# EasyEDA Pro project head_control.eprj, board PCB1
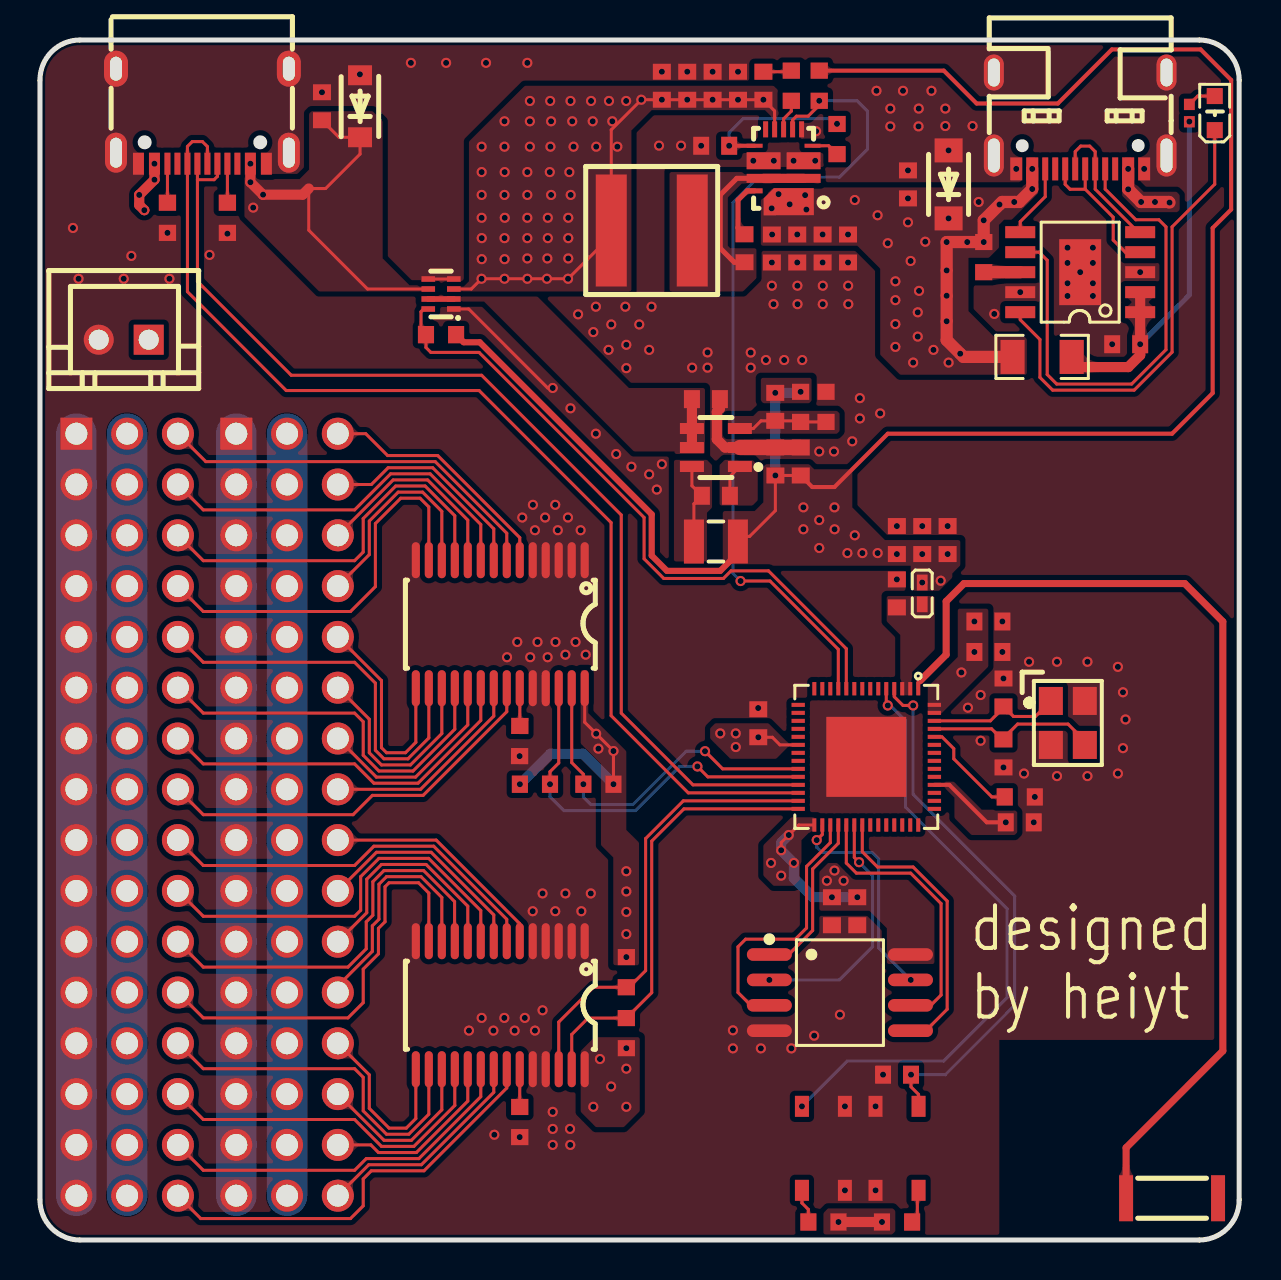
[diagram p2: board, top side]
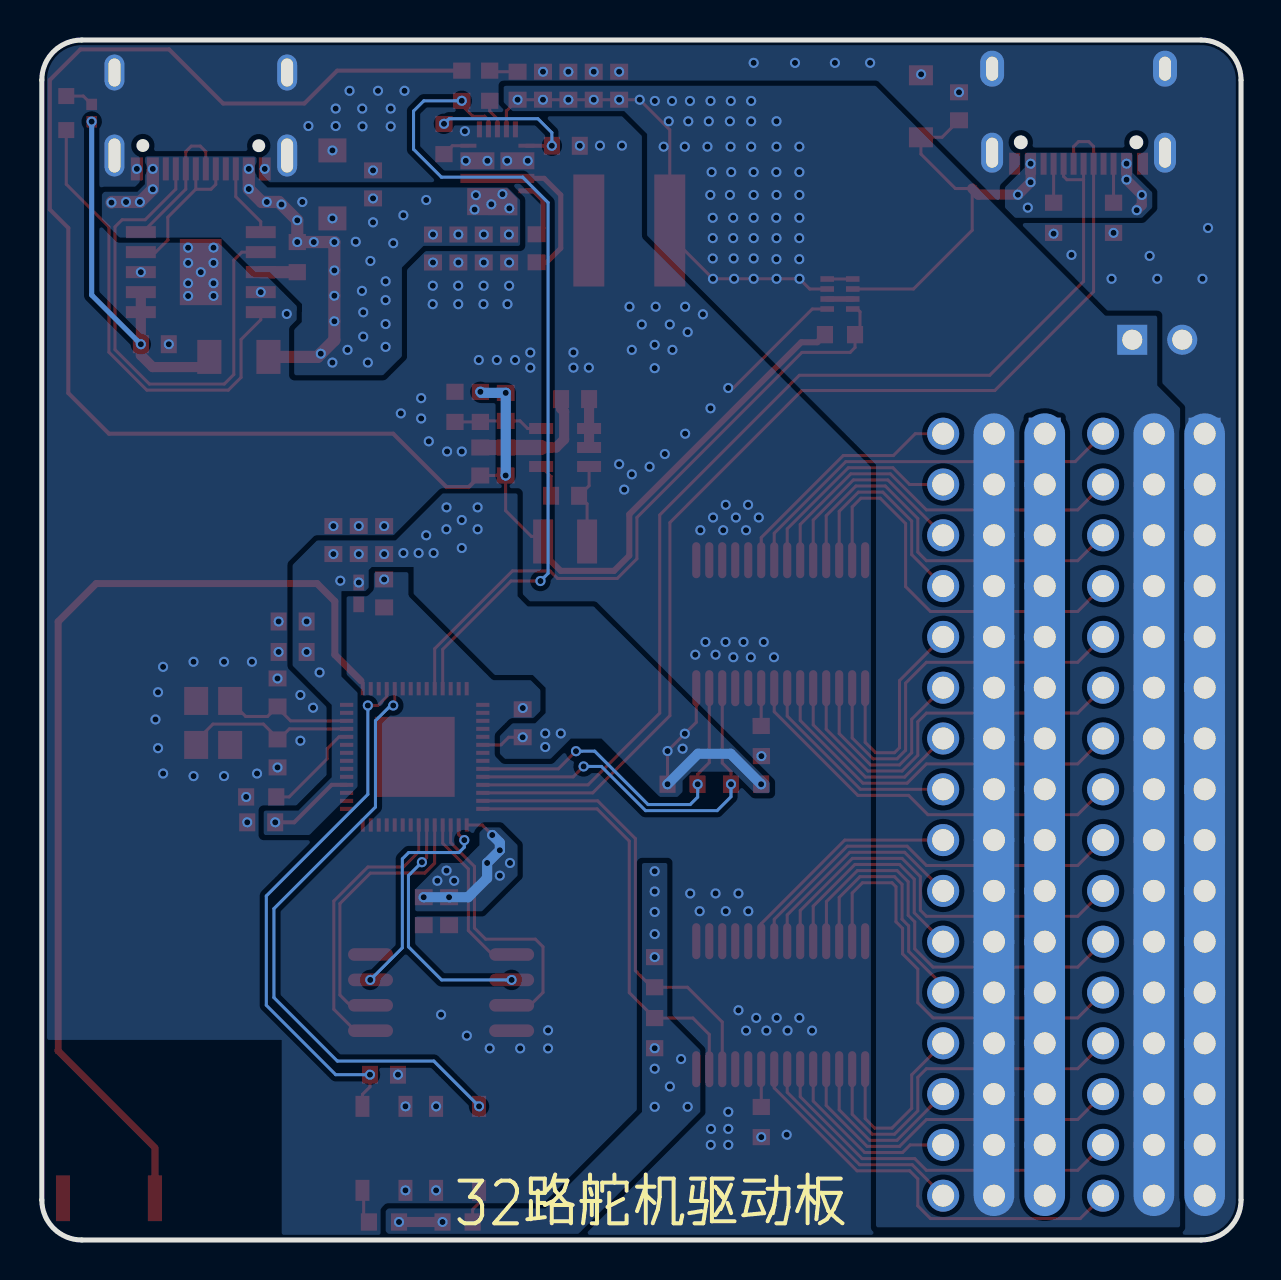
[diagram p3: board, bottom side, seen from below]

Outline 60 x 60 mm; copper layers: Top Layer, Inner1, Inner2, Bottom Layer. Coordinates in mm from the lower left corner of the outline.
Outline path: 0,58 0,2 arc(0.59,0.59) 2,0 58,0 arc(59.41,0.59) 60,2 60,58 arc(59.41,59.41) 58,60 2,60 arc(0.59,59.41) 0,58
Stack: Top Layer 0.035mm 外层铜厚1oz / Dielectric1 0.2104mm 7628 RC49% 8.6mil / Inner1 0.0152mm 内层铜厚 / Dielectric2 1.065mm 1.1mm H/HOZ Copper / Inner2 0.0152mm 内层铜厚 / Dielectric3 0.2104mm 7628 RC49% 8.6mil / Bottom Layer 0.035mm 外层铜厚1oz

## Design rules (mm)
template: 自定义配置
spacing copperThickness1oz (default): track to track 0.152, other pairs 0.152 to 0.3
spacing copperThickness2oz: track to track 0.203, other pairs 0.152 to 0.3
track width copperThickness1oz (default): min 0.102, default 0.152, max 2.54
track width copperThickness2oz: min 0.203, default 0.254, max 2.54
differential pair differentialPair (default): width min 0.127, default 0.254, max 2.54; gap min 0.152, default 0.152
via viaSize (default): diameter min 0.5, default 0.508, max 10; hole min 0.3, default 0.305, max 6.3

## Placement (name value [footprint] x y rotation side)
BOOT1  TSA016A2518A  [KEY-SMD_4P-L4.2-W3.4-P2.15-LS4.5-TL]  39.2 4.58 90 top
C1  100nF  [C0603]  47.45 29.4 180 top
C2  10pF  [C0603]  48.21 27.38 90 top
C3  1uF  [C0603]  42.88 8.27 180 top
C4  1uF  [C0603]  47.45 30.93 180 top
C5  10uF  [C0603]  42.87 35 270 top
C6  1uF  [C0603]  44.14 35 270 top
C7  100nF  [C0603]  45.41 35 270 top
C8  100nF  [C0603]  42.87 32.33 270 top
C9  10pF  [C0603]  48.21 24.33 270 top
C10  100nF  [C0603]  49.02 20.88 180 top
C11  100nF  [C0603]  35.94 25.84 270 top
C12  100nF  [C0603]  39.62 16.44 90 top
C13  22uF  [C0603]  36.79 38.93 90 top
C14  1uF  [C0603]  40.89 16.44 270 top
C15  22uF  [C0603]  38.06 38.93 90 top
C16  100nF  [C0603]  33.82 37.21 180 top
C17  220pF  [C0603]  36.79 41.66 270 top
C18  10uF  [C0603]  33.32 42.04 180 top
C19  1uF  [C0603]  54.35 44.79 180 top
C20  10uF  [C0603]  43.43 52.78 90 top
C21  100nF  [C0603]  35.25 49.59 270 top
C22  10uF  [C0603]  14.11 56.69 90 top
C23  100nF  [C0603]  40.43 49.58 90 top
C24  100pF  [C0603]  36.19 57.71 270 top
C25  2.2uF  [C0603]  33.78 54.71 180 top
CN2  HX-XH2.54-2PZZ  [CONN-TH_2P-P2.50_HX-2.54MM-2P-ZZ-MS]  4.19 45.01 180 top
D1  SMF20A  [SOD-123FL_L2.8-W1.9-LS3.7-RD]  45.46 52.78 90 top
D2  SMF5.0A  [SOD-123F_L2.8-W1.8-LS3.7-RD]  16.01 56.69 90 top
H2  KH-2.54PH180-3X16P-L11.5  [HDR-TH_48P-P2.54-V-M-R3-C16-S2.54_1]  12.36 21.27 270 top
H3  KH-2.54PH180-3X16P-L11.5  [HDR-TH_48P-P2.54-V-M-R3-C16-S2.54_1]  4.36 21.27 270 top
L1  2nH  [L0402]  44.14 32.33 270 top
L2  2.2uH  [IND-SMD_L2.5-W2.0_MHCHL2520]  33.82 34.93 0 top
LED1  SZYY0603R  [LED0603-R-RD]  58.78 56.35 90 top
R1  4.7kΩ  [R0603]  42.88 0.9 0 top
R2  10kΩ  [R0603]  24 5.9 270 top
R3  10kΩ  [R0603]  24 24.95 269.6 top
R4  4.7kΩ  [R0603]  39.2 0.9 180 top
R5  4.7kΩ  [R0603]  27.94 22.79 180 top
R6  4.7kΩ  [R0603]  24.76 22.79 0 top
R7  4.7kΩ  [R0603]  29.34 10.34 90 top
R8  4.7kΩ  [R0603]  29.34 13.39 270 top
R9  100kΩ  [R0603]  38.06 41.66 90 top
R10  22.1kΩ  [R0603]  39.33 41.66 90 top
R11  1kΩ  [R1206]  50.14 44.15 180 top
R12  4.7kΩ  [R0402]  57.51 56.35 90 top
R13  10kΩ  [R0603]  47.22 49.14 270 top
R14  5.1kΩ  [R0603]  9.38 51.11 270 top
R15  1kΩ  [R0603]  37.59 57.71 270 top
R16  5.1kΩ  [R0603]  6.38 51.11 270 top
R17  100kΩ  [R0603]  39.88 55.05 90 top
R18  10kΩ  [R0603]  20.07 45.27 0 top
R28  10kΩ  [R0603]  38.99 57.71 270 top
R29  10kΩ  [R0603]  49.02 22.15 180 top
RST1  TSA016A2518A  [KEY-SMD_4P-L4.2-W3.4-P2.15-LS4.5-TL]  42.88 4.58 90 top
U1  ADWH002  [ANT-SMD_L5.0-W2.0_HM5B]  56.64 2.09 180 top
U2  PCA9685PW,118  [TSSOP-28_L9.7-W4.4-P0.65-LS6.4-TL]  23.03 11.74 270 top
U3  PCA9685PW,118  [TSSOP-28_L9.7-W4.4-P0.65-LS6.4-TL]  23.03 30.79 270 top
U4  ESP32-S3R8  [QFN-56_L7.0-W7.0-P0.40-TL-EP4.0]  41.34 24.16 270 top
U5  BY25Q64ASSIG(T)  [SOIC-8_L5.3-W5.3-P1.27-LS8.0-BL]  40.02 12.37 270 top
U6  SY8113IADC  [TSOT-23-6_L2.9-W1.6-P0.95-LS2.8-BL]  33.82 39.62 90 top
U7  LM66200DRLR  [SOT-583-8_L2.1-W1.2-P0.50-LS1.6-BL]  20.07 47.3 90 top
U8  CH224K  [ESSOP-10_L4.9-W3.9-P1.0-LS6.0-TL-EP]  52.05 48.39 90 top
U9  1.5uH  [IND-SMD_L6.6-W6.4_FEXL0630A-1R5M]  30.61 50.47 270 top
U16  22uF  [C0603]  34.93 57.71 270 top
U17  22uF  [C0603]  33.66 57.71 270 top
U18  22uF  [C0603]  32.38 57.71 270 top
U19  22uF  [C0603]  31.12 57.71 270 top
U20  TPS513885VABR  [VQFN-HR-13_L4.0-W3.0_TPS51388VABR]  37.21 53.72 180 top
U21  22uF  [C0603]  36.62 49.58 90 top
U22  22uF  [C0603]  37.89 49.58 90 top
U23  22uF  [C0603]  39.16 49.58 90 top
USB1  TYPEC-304-ACP16  [USB-C-SMD_TYPE-C-16P-1]  52.05 55.97 180 top
USB2  TYPE-C 16PIN 2MD(073)  [USB-C-SMD_TYPE-C-6PIN-2MD-073]  8.13 56.19 180 top
X1  40MHz  [OSC-SMD_4P-L3.2-W2.5-BL_SIT8008BI]  51.43 25.85 270 top

## Footprints (pads in the part's own frame, mm; a bottom-side part is the same pattern mirrored in y, then rotated)
ANT-SMD_L5.0-W2.0_HM5B
  rect 0.7x2.3 smd: 1(-2.3,0) 2(2.3,0)
C0603
  rect 0.8x0.9 smd: 1(-0.7,0) 2(0.7,0)
CONN-TH_2P-P2.50_HX-2.54MM-2P-ZZ-MS
  rect 1.5x1.5 hole 1: 1(-1.25,0)
  round 1.5 hole 1: 2(1.25,0)
ESSOP-10_L4.9-W3.9-P1.0-LS6.0-TL-EP
  rect 0.6x1.5 smd: 1(-2,-3) 2(-1,-3) 3(0,-3) 4(1,-3) 5(2,-3) 6(2,3) 7(1,3) 8(0,3) 9(-1,3) 10(-2,3)
  rect 3.3x2.1 smd: 11(0,0)
HDR-TH_48P-P2.54-V-M-R3-C16-S2.54_1
  rect 1.6x1.6 hole 1.1: 1(-19.05,-2.54)
  round 1.6 hole 1.1: 2(-19.05,0) 3(-19.05,2.54) 4(-16.51,-2.54) 5(-16.51,0) 6(-16.51,2.54) 7(-13.97,-2.54) 8(-13.97,0) 9(-13.97,2.54) 10(-11.43,-2.54) 11(-11.43,0) 12(-11.43,2.54) 13(-8.89,-2.54) 14(-8.89,0) 15(-8.89,2.54) 16(-6.35,-2.54) 17(-6.35,0) 18(-6.35,2.54) 19(-3.81,-2.54) 20(-3.81,0) 21(-3.81,2.54) 22(-1.27,-2.54) 23(-1.27,0) 24(-1.27,2.54) 25(1.27,-2.54) 26(1.27,0) 27(1.27,2.54) 28(3.81,-2.54) 29(3.81,0) 30(3.81,2.54) 31(6.35,-2.54) 32(6.35,0) 33(6.35,2.54) 34(8.89,-2.54) 35(8.89,0) 36(8.89,2.54) 37(11.43,-2.54) 38(11.43,0) 39(11.43,2.54) 40(13.97,-2.54) 41(13.97,0) 42(13.97,2.54) 43(16.51,-2.54) 44(16.51,0) 45(16.51,2.54) 46(19.05,-2.54) 47(19.05,0) 48(19.05,2.54)
IND-SMD_L2.5-W2.0_MHCHL2520
  rect 1x2.2 smd: 1(-1.1,0) 2(1.1,0)
IND-SMD_L6.6-W6.4_FEXL0630A-1R5M
  rect 5.6x1.55 smd: 1(0,2.025) 2(0,-2.025)
KEY-SMD_4P-L4.2-W3.4-P2.15-LS4.5-TL
  rect 1.05x0.7 smd: 1(-2.1,1.075) 2(2.1,1.075) 3(-2.1,-1.075) 4(2.1,-1.075)
L0402
  rect 0.79x0.54 smd: 1(-0.545,0) 2(0.545,0)
LED0603-R-RD
  rect 0.8x0.8 smd: 1(0.851,0) 2(-0.851,0)
OSC-SMD_4P-L3.2-W2.5-BL_SIT8008BI
  rect 1.4x1.2 smd: 1(-1.1,-0.85) 2(1.1,-0.85) 3(1.1,0.85) 4(-1.1,0.85)
QFN-56_L7.0-W7.0-P0.40-TL-EP4.0
  rect 0.665x0.2 smd: 1(-3.408,2.6) 2(-3.408,2.2) 3(-3.408,1.8) 4(-3.408,1.4) 5(-3.408,1) 6(-3.408,0.6) 7(-3.408,0.2) 8(-3.408,-0.2) 9(-3.408,-0.6) 10(-3.408,-1) 11(-3.408,-1.4) 12(-3.408,-1.8) 13(-3.408,-2.2) 14(-3.408,-2.6) 29(3.408,-2.6) 30(3.408,-2.2) 31(3.408,-1.8) 32(3.408,-1.4) 33(3.408,-1) 34(3.408,-0.6) 35(3.408,-0.2) 36(3.408,0.2) 37(3.408,0.6) 38(3.408,1) 39(3.408,1.4) 40(3.408,1.8) 41(3.408,2.2) 42(3.408,2.6)
  rect 0.2x0.665 smd: 15(-2.6,-3.408) 16(-2.2,-3.408) 17(-1.8,-3.408) 18(-1.4,-3.408) 19(-1,-3.408) 20(-0.6,-3.408) 21(-0.2,-3.408) 22(0.2,-3.408) 23(0.6,-3.408) 24(1,-3.408) 25(1.4,-3.408) 26(1.8,-3.408) 27(2.2,-3.408) 28(2.6,-3.408) 43(2.6,3.408) 44(2.2,3.408) 45(1.8,3.408) 46(1.4,3.408) 47(1,3.408) 48(0.6,3.408) 49(0.2,3.408) 50(-0.2,3.408) 51(-0.6,3.408) 52(-1,3.408) 53(-1.4,3.408) 54(-1.8,3.408) 55(-2.2,3.408) 56(-2.6,3.408)
  rect 4x4 smd: 57(0,0)
R0402
  rect 0.566x0.54 smd: 1(-0.433,0) 2(0.433,0)
R0603
  rect 0.806x0.864 smd: 1(-0.753,0) 2(0.753,0)
R1206
  rect 1.208x1.701 smd: 1(-1.479,0) 2(1.479,0)
SOD-123F_L2.8-W1.8-LS3.7-RD
  rect 1x1.2 smd: 1(-1.55,0) 2(1.55,0)
SOD-123FL_L2.8-W1.9-LS3.7-RD
  rect 1.2x1.4 smd: 1(-1.7,0) 2(1.7,0)
SOIC-8_L5.3-W5.3-P1.27-LS8.0-BL
  oval 0.63x2.25 smd: 1(-1.905,-3.53) 2(-0.635,-3.53) 3(0.635,-3.53) 4(1.905,-3.53) 5(1.905,3.53) 6(0.635,3.53) 7(-0.635,3.53) 8(-1.905,3.53)
SOT-583-8_L2.1-W1.2-P0.50-LS1.6-BL
  rect 0.28x0.68 smd: 1(-0.75,-0.64) 2(-0.25,-0.64) 3(0.25,-0.64) 4(0.75,-0.64) 5(0.75,0.64) 6(0.25,0.64) 7(-0.25,0.64) 8(-0.75,0.64)
TSOT-23-6_L2.9-W1.6-P0.95-LS2.8-BL
  rect 0.55x1.2 smd: 1(-0.95,-1.2) 2(0,-1.2) 3(0.95,-1.2) 4(0.95,1.2) 5(0,1.2) 6(-0.95,1.2)
TSSOP-28_L9.7-W4.4-P0.65-LS6.4-TL
  oval 1.804x0.406 smd: 1(-3.2,4.225) 2(-3.2,3.575) 3(-3.2,2.925) 4(-3.2,2.275) 5(-3.2,1.625) 6(-3.2,0.975) 7(-3.2,0.325) 8(-3.2,-0.325) 9(-3.2,-0.975) 10(-3.2,-1.625) 11(-3.2,-2.275) 12(-3.2,-2.925) 13(-3.2,-3.575) 14(-3.2,-4.225) 15(3.2,-4.225) 16(3.2,-3.575) 17(3.2,-2.925) 18(3.2,-2.275) 19(3.2,-1.625) 20(3.2,-0.975) 21(3.2,-0.325) 22(3.2,0.325) 23(3.2,0.975) 24(3.2,1.625) 25(3.2,2.275) 26(3.2,2.925) 27(3.2,3.575) 28(3.2,4.225)
USB-C-SMD_TYPE-C-6PIN-2MD-073
  rect 0.55x1.1 smd: 1(-3.2,2.375) 2(-2.4,2.375) 11(2.4,2.375) 12(3.2,2.375)
  rect 0.3x1.1 smd: 3(-1.75,2.375) 4(-1.25,2.375) 5(-0.75,2.375) 6(-0.25,2.375) 7(0.25,2.375) 8(0.75,2.375) 9(1.25,2.375) 10(1.75,2.375)
  oval 1.1x2 hole 0.6x1.5: 13(-4.325,1.825) 14(4.325,1.825)
  oval 1.2x1.8 hole 0.6x1.2: 13(-4.325,-2.375) 14(4.325,-2.375)
USB-C-SMD_TYPE-C-16P-1
  rect 0.6x1.15 smd: A1B12(-3.2,2.41) A4B9(-2.4,2.41) B1A12(3.2,2.41) B4A9(2.4,2.41)
  rect 0.3x1.15 smd: A5(-1.25,2.41) A6(-0.25,2.41) A7(0.25,2.41) A8(1.25,2.41) B5(1.75,2.41) B6(0.75,2.41) B7(-0.75,2.41) B8(-1.75,2.41)
  oval 1x2.1 hole 0.6x1.7: EP(-4.32,1.74) EP(4.32,1.74)
  oval 1x1.8 hole 0.6x1.4: EP(-4.32,-2.41) EP(4.32,-2.41)
VQFN-HR-13_L4.0-W3.0_TPS51388VABR
  custom 2.515x1.36 smd: 1(-0.257,1.81)
  rect 1.7x0.45 smd: 2(-1,0.64) 12(1,0.64)
  rect 1.7x0.85 smd: 3(-1,-0.24) 11(1,-0.24)
  rect 0.8x0.2 smd: 4(-1.45,-0.99) 10(1.45,-0.99)
  rect 0.25x0.8 smd: 5(-0.9,-1.81) 6(-0.45,-1.81) 7(0,-1.81) 8(0.45,-1.81) 9(0.9,-1.81)
  rect 0.8x0.25 smd: 13(1.45,1.265)

## Nets
As in the schematic.

Pads without a net: U1 1; U4 6 7 8 9 12 13 14 15 16 17 18 19 21 22 36 37 38 39 40 41 42 43 44 45 47 48 49 50 51; U20 9; USB1 A8 B8; USB2 3 9

## Via types
v1: diameter 0.508, hole 0.305, Top Layer to Bottom Layer, 353 vias

## Routing (per net, layer and track width the routed paths; a pad name or vN(x,y) marks a point on that pad's centre or on a via; arc(x,y) is an arc through that point)
3V3: length 114.3
  Top Layer w0.152: C15.1 v1(36.79,38.23) 36.79,36.47 35.5,35.18 34.92,35.18 ; v1(35.94,25.14) 36.64,25.14 37.02,24.76 U4.20 ; U3.28 27.25,25.89 v1(27.83,25.31) v1(28.69,24.45) v1(28.69,22.79)
  Top Layer w0.203: v1(48.32,20.88) 47.37,20.88 45.5,22.76 U4.46 ; C15.1 38.64,37.65 39.75,37.65 42.42,40.31 56.64,40.31 58.67,42.35 58.67,50.6 59.6,51.53 59.6,58 58.07,59.53 53.63,59.53 50.93,56.83 46.86,56.83 45.22,58.47 R28.1
  Top Layer w0.305: 34.92,35.18 35.12,34.97 35.12,34.54 34.04,33.46 31.37,33.46 30.61,34.22 30.61,36.28 22,44.89 21.2,44.89 R18.2
  Top Layer w0.508: v1(39.95,0.9) v1(42.13,0.9)
  Bottom Layer w0.152: v1(36.79,38.23) 36.79,38.23
  Bottom Layer w0.508: v1(28.69,22.79) 27.17,24.31 25.54,24.31 v1(24.01,22.79) ; 36.79,38.23 v1(36.79,42.36) 38.01,42.36 v1(38.06,42.41)
  vias: v1(27.69,6.66) v1(27.94,24.57) v1(28.02,9.05) v1(28.57,7.68) v1(29.34,18.44) v1(29.34,17.43) v1(29.34,16.4) v1(29.34,15.3) v1(29.34,14.14) v1(29.34,9.59) v1(29.34,8.56) v1(29.34,6.66) v1(34.04,25.33) v1(34.81,25.33) v1(34.81,24.65) v1(38.2,36.63) v1(38.2,35.54) v1(38.99,36) v1(38.99,34.6) v1(39.75,36.63) v1(39.76,35.54) v1(40.4,34.35) v1(40.77,35.23) v1(41.15,34.35) v1(41.91,34.35) v1(42.87,34.3) v1(44.14,34.3) v1(44.14,32.87) v1(45.07,32.96) v1(45.41,34.3) v1(46.1,28.38) v1(46.75,30.93) v1(46.75,29.4)
+5V: length 22.6
  Top Layer w0.152: C22.1 14.96,55.14 D2.1 16.01,54.3 14.29,52.57 13.45,52.57 13.45,50.49 16.39,47.55 U7.6
  Top Layer w0.508: v1(5.22,51.49) 4.97,51.75 v1(4.97,52.25) v1(5.73,53.02) v1(5.73,53.81) ; v1(10.53,53.81) v1(10.53,52.89) 11.15,52.27 v1(11.16,52.27) 13.14,52.27 13.45,52.57
  vias: v1(10.67,51.62)
GND: length 90.5
  Top Layer w0.152: U7.4 U7.5 ; v1(25.65,42.6) 25.4,42.6 21.45,46.55 U7.1
  Top Layer w0.508: U6.2 34.27,39.62 33.87,40.03 33.87,41.42 34.02,41.57 C18.1
  Top Layer w0.762: 35.02,39.63 C13.2 C15.2
  Bottom Layer w2.032: H3.46 H3.43 H3.40 H3.37 H3.34 H3.31 H3.28 H3.25 H3.22 H3.19 H3.16 H3.13 H3.10 H3.7 H3.4 H3.1 ; H2.46 H2.43 H2.40 H2.37 H2.34 H2.31 H2.28 H2.25 H2.22 H2.19 H2.16 H2.13 H2.10 H2.7 H2.4 H2.1
  vias: v1(1.65,50.6) v1(1.93,48.06) v1(4.19,48.06) v1(4.57,49.2) v1(6.38,50.36) v1(6.48,48.06) v1(8.48,49.25) v1(9.38,50.31) v1(14.11,57.39) v1(16.01,58.28) v1(18.56,58.86) v1(20.32,58.86) v1(21.46,10.47) v1(22.1,11.1) v1(22.32,58.86) v1(22.69,10.47) v1(22.73,5.26) v1(23.23,11.1) v1(23.37,29.14) v1(23.75,10.47) v1(23.88,29.9) v1(24,24.19) v1(24,5.14) v1(24.13,36.12) v1(24.26,11.1) v1(24.38,58.86) v1(24.53,29.14) v1(24.66,36.76) v1(24.65,16.44) v1(24.76,35.49) v1(24.76,10.47) v1(24.89,29.9) v1(25.15,17.33) v1(25.15,11.49) v1(25.27,36.12) v1(25.4,29.14) v1(25.65,6.41) v1(25.65,5.55) v1(25.65,4.75) v1(25.78,36.76) v1(25.79,29.9) v1(25.78,16.44) v1(25.91,35.49) v1(26.29,29.27) v1(26.29,17.33) v1(26.42,36.12) v1(26.54,41.58) v1(26.52,5.55) v1(26.53,4.75) v1(26.8,29.9) v1(26.92,46.28) v1(27.05,35.49) v1(27.09,16.44) v1(27.31,29.27) v1(27.56,17.33) v1(27.69,45.39) v1(27.81,46.67) v1(27.81,40.31) v1(28.45,44.51) v1(28.58,45.78) v1(28.83,39.3) v1(29.29,46.67) v1(29.34,44.76) v1(29.34,43.59) v1(29.59,38.66) v1(29.98,45.78) v1(30.48,44.51) v1(30.48,38.28) v1(30.6,46.67) v1(30.86,37.52) v1(30.97,54.72) v1(31.12,58.41) v1(31.12,38.79) v1(32.07,54.72) v1(32.38,58.41) v1(32.63,43.62) v1(33.08,54.71) v1(33.4,44.38) v1(33.4,43.62) v1(33.66,58.41) v1(34.67,10.48) v1(34.67,9.58) v1(34.93,58.41) v1(35.56,44.37) v1(35.56,43.62) v1(35.69,53.96) v1(35.93,26.6) v1(36.07,9.58) v1(36.32,44) v1(36.62,48.88) v1(36.62,47.71) v1(36.72,53.96) v1(36.7,46.79) v1(37.23,44) v1(37.59,9.58) v1(37.7,53.96) v1(37.89,48.88) v1(37.9,47.71) v1(37.9,46.79) v1(38.14,44) v1(38.74,10.22) v1(38.83,55.44) v1(38.79,53.96) v1(38.99,39.43) v1(39.16,48.88) v1(39.17,47.71) v1(39.16,46.79) v1(39.72,39.43) v1(40.02,11.27) v1(40.27,6.68) v1(40.27,2.48) v1(40.43,48.88) v1(40.44,47.71) v1(40.44,46.79) v1(40.64,39.93) v1(41.02,42.09) v1(41.02,41.08) v1(41.81,6.68) v1(41.81,2.48) v1(41.85,57.46) v1(42.04,41.33) v1(42.18,8.27) v1(42.54,56.57) v1(42.54,55.68) v1(42.87,35.7) v1(42.87,33.03) v1(43.18,57.46) v1(43.43,53.48) v1(43.97,56.57) v1(43.96,55.68) v1(44.14,35.7) v1(44.6,57.46) v1(45.3,56.57) v1(45.3,55.7) v1(45.41,35.7) v1(45.46,54.48) v1(46.43,26.61) v1(46.66,55.7) v1(47.06,27.25) v1(47.06,24.96) v1(47.75,46.3) v1(48.15,30.93) v1(48.15,29.4) v1(48.21,28.08) v1(48.21,23.63) v1(48.85,53.56) v1(49.05,47.39) v1(49.23,23.32) v1(49.49,28.91) v1(49.72,20.88) v1(49.78,22.15) v1(50.88,28.91) v1(50.88,23.2) v1(51.41,49.61) v1(51.41,48.85) v1(51.41,47.84) v1(51.41,47.2) v1(52.05,48.39) v1(52.41,28.91) v1(52.41,23.2) v1(52.68,49.61) v1(52.68,48.85) v1(52.68,47.84) v1(52.68,47.2) v1(53.65,44.79) v1(53.93,28.66) v1(53.93,23.32) v1(54.19,27.39) v1(54.19,24.59) v1(54.31,26.03) v1(55.05,48.39) v1(55.25,53.56)
VDD_SPI: length 8.6
  Top Layer w0.152: U4.29 37.97,20.75 v1(37.47,20.25) 37.08,19.87 v1(37.08,19.49)
  Bottom Layer w0.508: v1(37.47,20.25) 37.08,19.87 v1(37.08,19.49) v1(37.72,18.85) 37.72,18.09 38.67,17.14 v1(39.62,17.14) v1(40.89,17.14)
  vias: v1(36.58,18.85) v1(37.08,18.22) v1(39.37,17.96) v1(39.75,18.47) v1(40.21,17.96)
BOOT: length 30.5
  Top Layer w0.152: v1(42.42,26.73) 42.34,26.8 U4.5
  Bottom Layer w0.152: v1(42.42,26.73) 42.54,26.73 43.31,25.96 43.31,21.65 48.39,16.57 48.39,12.12 45.21,8.95 40.39,8.95 v1(38.12,6.68)
CC1: length 25.1
  Top Layer w0.152: USB1.A5 53.3,52.55 54.83,51.01 55.98,51.01 56.34,50.66 56.34,44.52 54.62,42.8 50.87,42.8 50.39,43.27 50.39,48.99 49.99,49.39 U8.7
CC2: length 3.7
  Top Layer w0.152: USB1.B5 50.3,52.17 49.05,50.92 U8.6
CH224K_VDD: length 19.2
  Top Layer w0.508: R11.1 51.62,44.07 52.05,43.65 54.45,43.65 55.05,44.24 v1(55.05,44.79) U8.1 U8.2
  Bottom Layer w0.254: v1(57.51,55.92) 57.51,47.25 v1(55.05,44.79)
CHIP_EN: length 27
  Top Layer w0.152: v1(43.69,26.73) 43.18,26.73 42.74,27.16 U4.4 ; v1(43.58,8.27) 43.58,7.66 43.96,7.28 RST1.4
  Bottom Layer w0.152: v1(43.69,26.73) 43.69,22.28 48.77,17.2 48.77,11.74 45.29,8.27 v1(43.58,8.27)
DIODE_ST: length 33.1
  Top Layer w0.152: U4.10 40.34,29.56 36.45,33.46 34.57,33.46 34.19,33.08 31.21,33.08 30.23,34.06 30.23,36.12 21.97,44.38 19.56,44.38 19.31,44.62 R18.1 19.06,45.52 19.06,46.41 19.2,46.55 U7.8
PD_5V: length 100.4
  Top Layer w0.152: U20.8 36.76,56.45 v1(36.19,57.01) v1(34.93,57.01) v1(33.66,57.01) v1(32.38,57.01) v1(31.12,57.01) v1(30.09,57.01) 28.58,55.51 U9.2 28.58,50.22 v1(26.42,48.06) v1(25.36,48.06) v1(24.38,48.06) v1(23.24,48.06) v1(22.09,48.06) 21.58,47.55 U7.3
  Bottom Layer w2.032: H2.2 H2.5 H2.8 H2.11 H2.14 H2.17 H2.20 H2.23 H2.26 H2.29 H2.32 H2.35 H2.38 H2.41 H2.44 H2.47 ; H3.2 H3.5 H3.8 H3.11 H3.14 H3.17 H3.20 H3.23 H3.26 H3.29 H3.32 H3.35 H3.38 H3.41 H3.44 H3.47
  vias: v1(22.1,54.67) v1(22.1,53.4) v1(22.1,52.25) v1(22.1,51.11) v1(22.1,50.09) v1(22.1,49.04) v1(23.24,55.94) v1(23.24,54.67) v1(23.25,53.4) v1(23.24,52.25) v1(23.24,50.09) v1(23.25,49.04) v1(23.25,51.11) v1(24.38,53.4) v1(24.38,52.25) v1(24.38,51.11) v1(24.38,50.09) v1(24.38,49.08) v1(24.51,56.95) v1(24.51,55.94) v1(24.51,54.67) v1(25.41,51.11) v1(25.41,50.09) v1(25.39,49.08) v1(25.53,56.95) v1(25.54,54.67) v1(25.51,53.4) v1(25.57,55.94) v1(25.57,52.25) v1(26.43,51.11) v1(26.43,50.09) v1(26.43,49.08) v1(26.54,56.95) v1(26.49,53.4) v1(26.63,55.94) v1(26.55,52.25) v1(26.7,54.67) v1(27.57,56.95) v1(27.65,55.94) v1(27.83,54.67) v1(28.47,56.95) v1(28.63,55.94) v1(28.89,54.67) v1(29.33,56.95)
PD_20V: length 18.9
  Top Layer w0.61: v1(47.22,49.9) v1(47.22,50.99) v1(48.01,51.77) 48.14,51.9 v1(48.74,51.9) 49,51.9 v1(49.65,52.55) v1(49.65,53.56) ; v1(54.45,53.56) v1(54.45,52.54) 55.08,51.9 v1(55.09,51.9) v1(55.79,51.9) 56.49,51.9 v1(56.51,51.87) ; 47.22,49.9 v1(46.39,49.9) v1(45.36,49.9) v1(45.36,48.48) v1(45.36,47.21) v1(45.36,45.94) 45.36,44.99 v1(46.04,44.32) 46.2,44.15 R11.2
  vias: v1(36.61,51.58) v1(36.63,50.27) v1(36.95,52.29) v1(37.51,51.78) v1(37.89,50.28) v1(38.28,52.24) v1(38.35,51.52) v1(39.16,50.28) v1(40.43,50.28) v1(40.77,52) v1(41.91,51.24) v1(42.42,49.84) v1(42.8,47.94) v1(42.8,46.99) v1(42.8,45.8) v1(42.8,44.66) v1(43.43,52.08) v1(43.43,50.88) v1(43.56,48.95) v1(43.69,43.87) v1(43.92,46.39) v1(43.92,45.17) v1(43.98,47.46) v1(44.29,49.91) v1(44.7,44.51) v1(45.46,51.08) v1(45.46,43.87) v1(46.97,51.9)
PURE_5V: length 3.7
  Top Layer w0.28: U7.2 U7.7
  Top Layer w0.508: U6.5 U6.4 C18.2
SERVO00: length 12.4
  Top Layer w0.152: U3.6 24,35.12 19.9,39.22 17.39,39.22 16.3,40.31 H2.3
SERVO0A: length 10.7
  Top Layer w0.152: H2.18 16.48,26.04 16.48,24.36 17.09,23.75 18.54,23.75 20.1,25.32 U3.17
SERVO0B: length 19.5
  Top Layer w0.152: U3.18 20.75,25.54 18.66,23.45 16.96,23.45 16.17,24.24 16.17,25.91 15.74,26.34 8.17,26.34 6.9,27.61
SERVO0C: length 10.2
  Top Layer w0.152: U3.19 21.41,25.76 18.79,23.14 16.83,23.14 H2.21
SERVO0D: length 19
  Top Layer w0.152: U3.20 22.06,25.98 18.92,22.84 16.71,22.84 15.74,23.81 8.17,23.81 6.9,25.08
SERVO0E: length 10.7
  Top Layer w0.152: H2.24 19.04,22.53 22.71,26.2 U3.21
SERVO0F: length 20.3
  Top Layer w0.152: 6.9,22.53 8.17,21.27 15.66,21.27 16.63,22.23 19.17,22.23 23.35,26.42 U3.22
SERVO01: length 19.9
  Top Layer w0.152: 6.9,40.31 8.3,38.92 19.77,38.92 23.35,35.34 U3.7
SERVO1A: length 8.8
  Top Layer w0.152: U2.17 20.1,6.51 18.58,4.98 17.21,4.98 H2.42
SERVO1B: length 17.6
  Top Layer w0.152: U2.18 20.75,6.73 18.71,4.68 17.09,4.68 15.74,6.03 8.17,6.03 6.9,7.29
SERVO1C: length 9.3
  Top Layer w0.152: H2.45 16.55,4.75 16.93,4.37 18.83,4.37 21.41,6.95 U2.19
SERVO1D: length 18.6
  Top Layer w0.152: 6.9,4.75 8.17,3.49 15.74,3.49 16.32,4.07 18.96,4.07 22.06,7.17 U2.20
SERVO1E: length 11.1
  Top Layer w0.152: H2.48 16.45,3.76 19.09,3.76 22.71,7.38 U2.21
SERVO1F: length 21.4
  Top Layer w0.152: U2.22 23.35,7.6 19.21,3.46 16.58,3.46 16.17,3.05 16.17,1.71 15.54,1.07 8.04,1.07 6.9,2.22
SERVO02: length 11
  Top Layer w0.152: H2.6 16.58,37.78 17.42,38.61 19.65,38.61 22.71,35.56 U3.8
SERVO03: length 19.3
  Top Layer w0.152: 6.9,37.78 8.17,36.5 15.74,36.5 17.54,38.31 19.52,38.31 22.06,35.78 U3.9
SERVO04: length 10.5
  Top Layer w0.152: U3.10 21.41,35.99 19.4,38 17.67,38 H2.9
SERVO05: length 19.7
  Top Layer w0.152: U3.11 20.75,36.21 19.27,37.7 17.8,37.7 16.17,36.07 16.17,34.4 15.74,33.97 8.17,33.97 6.9,35.23
SERVO06: length 11
  Top Layer w0.152: H2.12 16.48,34.27 16.48,35.95 17.92,37.39 19.14,37.39 20.1,36.43 U3.12
SERVO07: length 20.1
  Top Layer w0.152: 6.9,32.69 8.17,31.42 15.54,31.42 16.78,32.67 16.78,35.82 18.05,37.09 19.02,37.09 19.46,36.65 U3.13
SERVO08: length 11.2
  Top Layer w0.152: U3.15 18.81,24.88 18.29,24.36 17.34,24.36 17.09,24.61 17.09,27.97 H2.15
SERVO09: length 20
  Top Layer w0.152: U3.16 19.46,25.1 18.41,24.06 17.21,24.06 16.78,24.49 16.78,27.84 15.74,28.89 8.17,28.89 6.9,30.16
SERVO10: length 11.7
  Top Layer w0.152: U2.6 24,15.81 19.82,20 H2.27
SERVO11: length 20
  Top Layer w0.152: U2.7 23.35,16.03 19.7,19.69 16.71,19.69 15.74,18.72 8.17,18.72 6.9,20
SERVO12: length 11.2
  Top Layer w0.152: U2.8 22.71,16.25 19.57,19.39 16.83,19.39 H2.30
SERVO13: length 20.5
  Top Layer w0.152: U2.9 22.06,16.47 19.45,19.08 16.96,19.08 16.04,18.17 16.04,16.49 15.74,16.19 8.17,16.19 6.9,17.45
SERVO14: length 11.7
  Top Layer w0.152: U2.10 21.41,16.69 19.32,18.78 17.09,18.78 16.35,18.04 16.35,16.36 H2.33
SERVO15: length 20.8
  Top Layer w0.152: U2.11 20.74,14.95 20.74,16.92 19.19,18.47 17.21,18.47 16.65,17.91 16.65,16.24 16.32,15.91 16.32,14.56 15.41,13.64 8.17,13.64 6.9,14.92
SERVO16: length 12.2
  Top Layer w0.152: H2.36 14.9,12.71 16.63,14.43 16.63,15.71 16.96,16.04 16.96,17.79 17.34,18.17 19.07,18.17 20.1,17.13 U2.12
SERVO17: length 21.3
  Top Layer w0.152: U2.13 19.46,17.35 18.94,17.86 17.46,17.86 17.26,17.66 17.26,15.91 16.93,15.58 16.93,14.31 16.17,13.55 16.17,11.87 15.41,11.1 8.17,11.1 6.9,12.38
SERVO18: length 9.3
  Top Layer w0.152: H2.39 16.48,8.26 16.48,6.58 17.47,5.59 18.33,5.59 18.81,6.07 U2.15
SERVO19: length 18.1
  Top Layer w0.152: 6.9,9.84 8.17,8.56 15.74,8.56 16.17,8.13 16.17,6.46 17.34,5.29 18.45,5.29 19.46,6.29 U2.16
SERVO_0_SCL: length 19.4
  Top Layer w0.152: v1(32.89,23.68) 33.41,23.16 U4.24 ; U3.26 25.96,23.85 25.52,23.42 v1(25.52,22.79)
  Bottom Layer w0.152: v1(32.89,23.68) 32,23.68 29.79,21.47 26.21,21.47 25.52,22.16 v1(25.52,22.79)
SERVO_0_SDA: length 18.1
  Top Layer w0.152: v1(27.19,22.79) 27.19,23.29 26.6,23.87 U3.27 ; v1(33.27,24.44) 34.16,23.56 U4.23
  Bottom Layer w0.152: v1(27.19,22.79) 27.19,22.15 27.56,21.77 29.67,21.77 32.34,24.44 v1(33.27,24.44)
SERVO_1_SCL: length 22.8
  Top Layer w0.152: U2.26 25.96,10.9 27.69,12.64 R8.2 29.47,12.64 30.3,13.47 30.3,20.07 32.19,21.96 U4.27
SERVO_1_SDA: length 22.2
  Top Layer w0.152: U4.28 32.22,21.56 30.61,19.94 30.61,12.37 R7.2 27.42,11.1 26.6,10.28 U2.27
SPICLK: length 13.8
  Top Layer w0.152: U4.33 40.34,18.85 40.85,18.34 43.56,18.34 45.09,16.82 45.09,12.25 44.57,11.73 U5.6
SPICS0: length 8.5
  Top Layer w0.152: 39.94,20.75 39.94,19.84 38.66,18.55 38.66,15.47 37.46,14.27 U5.1
SPID: length 14.3
  Top Layer w0.152: U5.5 44.32,10.46 45.39,11.54 45.39,16.95 43.69,18.65 41.91,18.65 41.14,19.41 U4.35
SPIHD: length 11.3
  Top Layer w0.152: v1(38.86,20) 39.14,20.28 U4.30
  Bottom Layer w0.152: v1(43.57,13) 41.96,14.61 41.96,19.06 41.64,19.37 39.13,19.37 38.86,19.64 v1(38.86,20)
SPIQ: length 12.3
  Top Layer w0.152: U4.34 40.74,19.13 v1(40.98,18.89)
  Bottom Layer w0.152: v1(40.98,18.89) 41.66,18.22 41.66,14.66 40,13 v1(36.49,13)
SPIWP: length 13.6
  Top Layer w0.152: U5.3 35.57,11.73 34.93,12.38 34.93,14.66 35.31,15.04 37.8,15.04 38.35,15.6 38.35,18.68 39.54,19.87 39.54,20.75
TPS_EN: length 42
  Top Layer w0.152: v1(38.99,56.96) 38.99,56.75 38.43,56.19 37.85,56.19 37.66,56 U20.6 ; v1(35.05,32.95) 36.53,32.95 39.94,29.53 39.94,27.56
  Bottom Layer w0.152: v1(38.99,56.96) 40.89,56.96 41.4,56.44 41.4,54.54 40,53.14 35.94,53.14 34.67,51.87 34.67,33.33 v1(35.05,32.95)
USB_D+: length 7.6
  Top Layer w0.152: 52.3,52.54 USB1.A6 ; USB1.B6 51.3,52.78 51.54,52.54 52.3,52.54 53.7,51.14 53.7,50 54.3,49.39 U8.4
USB_D-: length 7.1
  Top Layer w0.152: USB1.A7 51.8,54.42 52.07,54.69 52.52,54.69 52.8,54.42 USB1.B7 52.8,52.54 54.95,50.39 U8.5
USB_ESP32_D+: length 55.9
  Top Layer w0.152: U4.26 32.44,22.36 28.57,26.22 28.57,35.87 21.97,42.47 12.32,42.47 7.38,47.42 USB2.8 7.38,54.68 7.62,54.92 8.13,54.92 8.38,54.67 USB2.6
USB_ESP32_D-: length 53.9
  Top Layer w0.152: USB2.5 8.88,53.18 8.71,53.02 7.88,53.02 ; 7.88,53.02 USB2.7 ; 7.88,53.02 7.88,47.93 12.57,43.24 22.1,43.24 29.08,36.25 29.08,26.34 32.67,22.76 U4.25
$1N1648: length 8.7
  Top Layer w0.152: U4.53 47.61,25.56 48.14,25.03 C9.1 48.21,25.09 48.91,25.8 51.44,25.8 52.28,24.96 X1.3
$1N1650: length 6.7
  Top Layer w0.152: X1.1 49.8,26.18 48.71,26.18 C2.1 48.21,26.61 47.55,25.96 U4.54
$1N1654: length 50.8
  Top Layer w0.152: 43.94,27.56 43.94,27.87 44.03,27.96
  Top Layer w0.35: U1.2 54.34,4.61 59.18,9.45 59.18,30.92 57.28,32.82 46.23,32.82 45.34,31.93 45.34,29.27 44.03,27.96
$1N7101: length 2
  Top Layer w0.152: USB2.10 R16.1
$1N7103: length 2
  Top Layer w0.152: USB2.4 R14.1
$1N12657: length 1.7
  Top Layer w0.152: BOOT1.1 38.12,1.85 38.44,1.53 R4.2
$1N15070: length 1.7
  Top Layer w0.152: RST1.3 43.9,2.42 43.9,1.16 R1.2
$1N15501: length 1.8
  Top Layer w0.61: 47.22,48.39 49.04,48.39
$1N15512: length 23.3
  Top Layer w0.152: U8.10 49.05,46.01 50.03,45.03 50.03,43.13 50.67,42.49 54.75,42.49 56.64,44.39 56.64,50.66 58.78,52.79 LED1.2
$1N15982: length 1.9
  Top Layer w0.152: R3.1 24.01,27.59 U3.23
$1N15983: length 1.9
  Top Layer w0.152: U2.23 24,8.54 R2.1
$1N16437: length 1.5
  Top Layer w0.152: 34.52,37.34 34.52,38.17 U6.1
$1N16446: length 3.9
  Top Layer w0.152: 32.72,35.18 32.72,36.81 C16.2 32.62,37.71 U6.6
$1N19020: length 4.5
  Top Layer w0.152: 39.33,40.9 38.06,40.9 38,40.96 C17.2 36.08,40.96 35.69,40.57 U6.3
$1N31983: length 8.7
  Top Layer w0.254: U20.12 34.87,53.08 34.04,52.25 34.04,49.59 34.74,48.89 C21.2
  Top Layer w0.457: U20.12 U20.2
$1N32212: length 2.9
  Top Layer w0.254: U20.13 35.38,52.46 34.93,52 34.93,50.61 C21.1
$1N32303: length 1.6
  Top Layer w0.152: U20.7 37.21,56.06 37.59,56.44 R15.2
$1N32377: length 1.4
  Top Layer w0.152: C24.1 37.54,58.41 R15.1
$1N32486: length 7.7
  Top Layer w0.152: v1(39.88,55.81) R17.2
  Top Layer w0.203: v1(34.48,54.71) U20.10
  Bottom Layer w0.152: v1(34.48,54.71) 34.48,55.37 35.18,56.06 39.62,56.06 v1(39.88,55.81)
$1N32507: length 1.4
  Top Layer w0.152: R17.1 39.46,54.71 U20.4
$1N35893: length 1.4
  Top Layer w0.152: LED1.1 57.93,57.2 R12.2
$1N42882: length 5.1
  Top Layer w0.152: U4.52 45.13,25.16 45.72,24.57 45.72,24.06 47.62,22.15 R29.2

## Copper pours and planes (outline as drawn; the poured copper is in the pictures)
3V3 on Top Layer: 46.61,20.25 45.75,21.1 45.75,22.12 45.22,22.66 44.42,22.66 44.42,22.92 45.72,22.92 47.12,21.52 48.77,21.52 48.9,21.39 48.9,20.38 48.77,20.25
3V3 on Top Layer: 45.65,33.12 44.98,32.46 43.71,32.46 43.56,32.61 43.56,33.71 34.16,33.71 34.16,36.44 35.75,36.44 36.19,36.89 36.19,38.66 36.32,38.79 38.48,38.79 38.74,38.54 40.64,38.54 40.64,36.63 42.28,35 46.05,35 46.05,33.73 45.65,33.33
3V3 on Top Layer: 29.97,13.77 29.94,13.74 28.68,13.74 28.68,19.13 28.07,19.74 28.07,23.81 27.05,24.82 27.05,28.5 27.43,28.5 27.43,26.34 29.34,24.44 29.34,20.5 29.97,19.87
3V3 on Top Layer: 47.44,31.57 45.92,31.57 45.92,29.15 44.42,27.65 44.42,26.26 45.03,26.26 47.44,28.67
3V3 on Top Layer: 37.43,24.66 36.83,24.06 34.54,24.06 33.53,25.08 33.53,25.58 33.78,25.84 36.45,25.84 37.34,24.95 38.27,24.95 38.27,24.66
3V3 on Top Layer: 39.2,0.28 42.64,0.28 42.8,0.44 42.8,1.45 42.67,1.58 39.43,1.58 39.2,1.35
3V3 on Top Layer: 27.05,9.45 27.74,10.14 30.01,10.14 30.01,6.44 29.21,5.64 27.81,5.64 27.05,6.41
3V3 on Top Layer: 36.07,43.11 38.61,43.11 38.61,41.97 38.48,41.84 36.19,41.84 36.07,41.97
3V3 on Bottom Layer: 46.61,20.25 44.2,22.66 44.2,27.36 45.01,28.17 45.01,32.44 43.81,32.44 43.64,32.61 43.64,33.5 43.5,33.65 41.4,33.65 41.4,32.31 37.34,28.25 35.43,28.25 34.8,27.61 34.8,26.34 35.31,25.84 36.45,25.84 37.08,25.2 37.08,24.31 36.83,24.06 34.54,24.06 33.53,25.08 32,25.08 29.08,22.15 28.19,22.15 27.94,22.41 27.94,22.97 27.49,23.42 25.4,23.42 24.32,22.34 23.57,22.34 23.57,22.87 27.42,26.73 27.43,26.73 32.38,31.68 35.69,31.68 36.19,32.19 36.19,37.33 39.94,37.33 42.29,34.98 46.23,34.98 47.45,33.76 47.45,28.71 45.5,26.76 45.5,23.14 47.16,21.47 48.9,21.47 48.9,20.25
3V3 on Bottom Layer: 42.8,0.44 42.67,0.31 33.15,0.31 27.05,6.41 27.05,9.49 28.7,11.14 28.7,18.85 29.97,18.85 29.97,6.41 29.97,6.4 34.79,1.58 42.67,1.58 42.8,1.45
+5V on Top Layer: 19.81,47.73 19.81,47.43 13.97,47.43 10.23,51.17 10.23,54.36 10.8,54.36 10.8,53.14 10.89,53.05 12.99,53.05 13.46,53.52 13.46,56.32 13.59,56.44 16.64,56.44 17.15,55.94 17.15,49.08 18.49,47.73
+5V on Bottom Layer: 5.43,54.36 10.83,54.36 10.83,53.62 11.81,52.63 11.81,51.62 11.3,51.11 4.95,51.11 4.44,51.62 4.44,52.38 5.43,53.36
GND on Top Layer: 24.38,15.8 24.51,15.93 27.56,15.93 27.81,15.68 27.81,14.28 27.43,13.9 24.51,13.9 24.38,14.03
GND on Top Layer: -3.3,65.72 64.9,65.72 64.9,-3.75 -3.3,-3.75
GND on Top Layer: 24.51,35.11 27.56,35.11 27.81,34.85 27.81,33.08 27.56,32.82 24.64,32.82 24.38,33.08 24.38,34.98
GND on Bottom Layer: -3.94,64.7 64.9,64.7 64.9,-1.59 -3.94,-1.59
GND on Inner1: -4.57,63.05 63.88,63.05 63.88,-3.88 -4.57,-3.88
GND on Inner2: -5.21,66.1 68.71,66.1 68.71,-5.15 -5.21,-5.15
VDD_SPI on Top Layer: 38.86,20.35 38.86,21.14 37.59,21.14 36.19,19.74 36.19,18.22 36.7,17.71 37.72,17.71 38.1,18.09 38.1,20 38.46,20.35
VDD_SPI on Top Layer: 44.79,16.67 44.79,13.8 42.38,13.8 42.38,15.58 41.49,16.46 38.95,16.46 38.95,18.43 39.37,18.85 39.88,18.85 40.61,18.12 43.34,18.12
VDD_SPI on Bottom Layer: 37.98,16.43 36.19,18.22 36.19,19.74 37.08,20.63 37.85,20.63 38.1,20.38 38.1,19.74 38.99,18.85 40,18.85 41.4,17.45 41.4,16.57 41.27,16.43
PD_5V on Top Layer: 20.32,47.43 20.32,47.68 21.21,47.68 21.46,47.94 21.46,54.92 24.26,57.71 36.7,57.71 36.96,57.46 36.96,55.12 36.58,55.12 36.58,56.19 36.27,56.49 30.61,56.49 29.59,55.48 29.59,47.43
PD_5V on Bottom Layer: 18.26,38.77 18.26,0.63 3.05,0.63 3.05,41.58 4.19,42.73 4.19,46.21 6.79,46.21 18.29,57.71 36.89,57.71 36.89,56.89 36.45,56.44 30.86,56.44 29.72,55.3 29.72,50.22
PD_20V on Top Layer: 43.04,43.27 42.04,44.27 42.04,48.57 40.89,49.71 36.07,49.71 36.07,52 36.7,52.63 49.13,52.63 49.35,52.85 49.35,54.13 49.95,54.13 49.95,52.34 48.62,51.01 48.24,51.01 47.98,50.76 47.98,49.61 47.47,49.11 46.46,49.11 46.46,46.44 47.73,45.17 49.25,45.17 49.38,45.04 49.38,43.27
PD_20V on Top Layer: 57.02,51.49 56.93,51.39 54.97,51.39 54.15,52.21 54.15,54.13 54.75,54.13 54.75,52.88 55.22,52.41 56.87,52.41 57.02,52.25
PD_20V on Bottom Layer: 47.37,43.24 42.93,43.24 41.98,44.18 41.98,48.62 40.9,49.7 36.08,49.7 36.07,49.71 36.07,52 36.7,52.63 48.71,52.63 49.25,53.17 49.25,54.19 54.84,54.19 54.84,52.79 55.22,52.41 56.87,52.41 57,52.28 57,51.01 56.11,50.12 51.05,50.12 49.32,48.39 48.58,48.39 46.98,46.8 46.98,46.42 46.99,46.41 46.99,45.9 47.37,45.52
PURE_5V on Top Layer: 33.27,42.6 33.27,39.3 31.75,39.3 31.75,42.6
PURE_5V on Top Layer: 19.05,47.26 24.81,47.26 29.46,42.6 33.02,42.6 33.02,39.81 32.64,39.43 29.72,39.43 22.22,46.92 19.05,46.92
$1N1665 on Top Layer: 44.77,29.53 43.64,28.4 43.64,27.23 43.04,27.23 43.04,30.25 42.36,30.93 42.36,32.2 44.77,32.2
$1N16437 on Top Layer: 34,38.75 34.26,39.01 35.65,39.01 35.91,38.75 35.91,36.98 35.65,36.72 34,36.72
$1N16446 on Top Layer: 33.37,33.93 33.37,36.36 33.62,36.62 33.62,38.75 33.37,39.01 31.72,39.01 31.72,33.93
$1N19020 on Top Layer: 34.42,41.2 35.69,41.2 35.94,41.46 39.88,41.46 40,41.33 40,40.44 39.88,40.31 34.42,40.31
$1N31983 on Top Layer: 31.5,53.4 39.05,53.4 39.05,52.83 35.12,52.83 34.42,52.13 34.42,49.71 34.54,49.59 35.85,49.59 35.85,48.1 35.18,47.43 31.5,47.43

Small or netless copper shapes (teardrops, artwork), in the pictures only: 233 on Top Layer, 20 on Bottom Layer

## Text on the board
Bottom Silkscreen Layer: 32路舵机驱动板
Top Silkscreen Layer: designed / by heiyt
